# EAGLE design Bus Definition V1.1 (EAGLE 7.6.0)
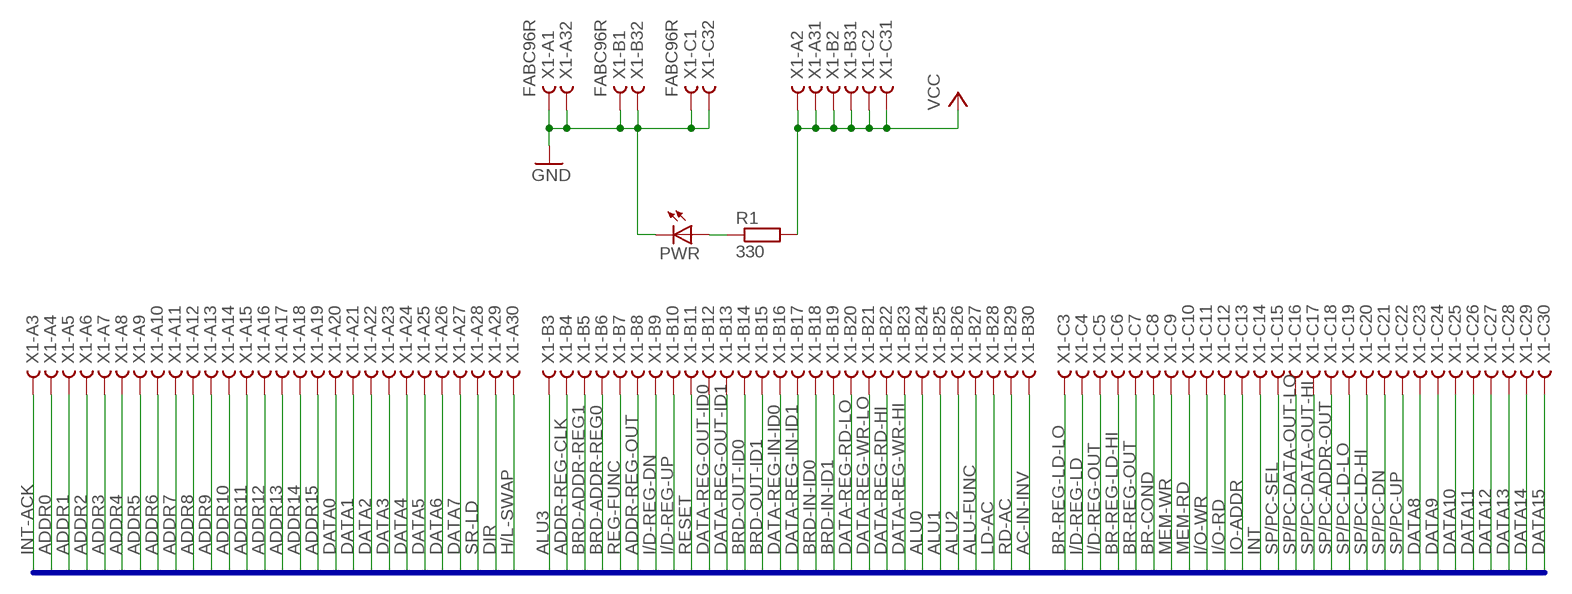
[diagram p0: schematic, sheet 1]

## Parts
PWR  LED5MM  [LED5MM]
R1  330  R0207/10  [0207/10]
X1  FABC96R  [FABC96R]

## Nets
AC-IN-INV: X1.B30
ADDR0: X1.A4
ADDR1: X1.A5
ADDR2: X1.A6
ADDR3: X1.A7
ADDR4: X1.A8
ADDR5: X1.A9
ADDR6: X1.A10
ADDR7: X1.A11
ADDR8: X1.A12
ADDR9: X1.A13
ADDR10: X1.A14
ADDR11: X1.A15
ADDR12: X1.A16
ADDR13: X1.A17
ADDR14: X1.A18
ADDR15: X1.A19
ADDR-REG-CLK: X1.B4
ADDR-REG-OUT: X1.B8
ALU0: X1.B24
ALU1: X1.B25
ALU2: X1.B26
ALU3: X1.B3
ALU-FUNC: X1.B27
BR-COND: X1.C8
BR-REG-LD-HI: X1.C6
BR-REG-LD-LO: X1.C3
BR-REG-OUT: X1.C7
BRD-ADDR-REG0: X1.B6
BRD-ADDR-REG1: X1.B5
BRD-IN-ID0: X1.B18
BRD-IN-ID1: X1.B19
BRD-OUT-ID0: X1.B14
BRD-OUT-ID1: X1.B15
DATA0: X1.A20
DATA1: X1.A21
DATA2: X1.A22
DATA3: X1.A23
DATA4: X1.A24
DATA5: X1.A25
DATA6: X1.A26
DATA7: X1.A27
DATA8: X1.C23
DATA9: X1.C24
DATA10: X1.C25
DATA11: X1.C26
DATA12: X1.C27
DATA13: X1.C28
DATA14: X1.C29
DATA15: X1.C30
DATA-REG-IN-ID0: X1.B16
DATA-REG-IN-ID1: X1.B17
DATA-REG-OUT-ID0: X1.B12
DATA-REG-OUT-ID1: X1.B13
DATA-REG-RD-HI: X1.B22
DATA-REG-RD-LO: X1.B20
DATA-REG-WR-HI: X1.B23
DATA-REG-WR-LO: X1.B21
DIR: X1.A29
GND: PWR.K(C) X1.A1 X1.A32 X1.B1 X1.B32 X1.C1 X1.C32
H/L-SWAP: X1.A30
I/D-REG-DN: X1.B9
I/D-REG-LD: X1.C4
I/D-REG-OUT: X1.C5
I/D-REG-UP: X1.B10
I/O-RD: X1.C12
I/O-WR: X1.C11
INT: X1.C14
INT-ACK: X1.A3
IO-ADDR: X1.C13
LD-AC: X1.B28
MEM-RD: X1.C10
MEM-WR: X1.C9
N$10: PWR.A R1.1
RD-AC: X1.B29
REG-FUNC: X1.B7
RESET: X1.B11
SP/PC-ADDR-OUT: X1.C18
SP/PC-DATA-OUT-HI: X1.C17
SP/PC-DATA-OUT-LO: X1.C16
SP/PC-DN: X1.C21
SP/PC-LD-HI: X1.C20
SP/PC-LD-LO: X1.C19
SP/PC-SEL: X1.C15
SP/PC-UP: X1.C22
SR-LD: X1.A28
VCC: R1.2 X1.A2 X1.A31 X1.B2 X1.B31 X1.C2 X1.C31

## Buses
ADDR[0..15],DATA[0..15],SR-LD,DIR,H/L-SWAP,ADDR-REG-CLK,BRD-ADDR-REG[0..1],REG-FUNC,ADDR-REG-OUT,I/D-REG-DN,I/D-REG-UP,RESET,DATA-REG-OUT-ID[0..1],BRD-OUT-ID[0..1],DATA-REG-IN-ID[0..1],BRD-IN-ID[0..1],DATA-REG-RD-LO,DATA-REG-WR-LO,DATA-REG-RD-HI,DATA-REG-WR-HI,ALU[0..3],ALU-FUNC,LD-AC,RD-AC,AC-IN-INV,BR-REG-LD-LO,I/D-REG-LD,I/D-REG-OUT,BR-REG-LD-HI,BR-REG-OUT,BR-COND,MEM-WR,MEM-RD,I/O-WR,I/O-RD,IO-ADDR,INT,SP/PC-SEL,SP/PC-DATA-OUT-LO,SP/PC-DATA-OUT-HI,SP/PC-ADDR-OUT,SP/PC-LD-LO,SP/PC-LD-HI,SP/PC-DN,SP/PC-UP,INT-ACK

## Library data of the parts
PWR = led:LED: LED OSRAM: - CHIPLED LG R971, LG N971, LY N971, LG Q971, LY Q971, LO R971, LY R971 LH N974, LH R974 LS Q976, LO Q976, LY Q976 LO Q996 - Hyper CHIPLED LW Q18S LB Q993, LB Q99A, LB R99A - SideLED LS A670, LO A670, LY A670, LG A670, LP A670 LB A673, LV A673, LT A673, LW A673 LH A674 LY A675 LS A676, LA A676, LO A676, LY A676, LW A676 LS A679, LY A679, LG A679 - Hyper Micro SIDELED® LS Y876, LA Y876, LO Y876, LY Y876 LT Y87S - SmartLED LW L88C, LW L88S LB L89C, LB L89S, LG L890 LS L89K, LO L89K, LY L89K LS L896, LA L896, LO L896, LY L896 - TOPLED LS T670, LO T670, LY T670, LG T670, LP T670 LSG T670, LSP T670, LSY T670, LOP T670, LYG T670 LG T671, LOG T671, LSG T671 LB T673, LV T673, LT T673, LW T673 LH T674 LS T676, LA T676, LO T676, LY T676, LB T676, LH T676, LSB T676, LW T676 LB T67C, LV T67C, LT T67C, LS T67K, LO T67K, LY T67K, LW E67C LS E67B, LA E67B, LO E67B, LY E67B, LB E67C, LV E67C, LT E67C LW T67C LS T679, LY T679, LG T679 LS T770, LO T770, LY T770, LG T770, LP T770 LB T773, LV T773, LT T773, LW T773 LH T774 LS E675, LA E675, LY E675, LS T675 LS T776, LA T776, LO T776, LY T776, LB T776 LHGB T686 LT T68C, LB T68C - Hyper Mini TOPLED® LB M676 - Mini TOPLED Santana® LG M470 LS M47K, LO M47K, LY M47K Source: http://www.osram.convergy.de LUXEON: - LUMILED® LXK2-PW12-R00, LXK2-PW12-S00, LXK2-PW14-U00, LXK2-PW14-V00 LXK2-PM12-R00, LXK2-PM12-S00, LXK2-PM14-U00 LXK2-PE12-Q00, LXK2-PE12-R00, LXK2-PE12-S00, LXK2-PE14-T00, LXK2-PE14-U00 LXK2-PB12-K00, LXK2-PB12-L00, LXK2-PB12-M00, LXK2-PB14-N00, LXK2-PB14-P00, LXK2-PB14-Q00 LXK2-PR12-L00, LXK2-PR12-M00, LXK2-PR14-Q00, LXK2-PR14-R00 LXK2-PD12-Q00, LXK2-PD12-R00, LXK2-PD12-S00 LXK2-PH12-R00, LXK2-PH12-S00 LXK2-PL12-P00, LXK2-PL12-Q00, LXK2-PL12-R00 Source: www.luxeon.com KINGBRIGHT: KA-3528ASYC Source: www.kingbright.com
R1 = eagle-ltspice:R: RESISTOR, European symbol; SPICEMODEL: NONE; SPICEPREFIX: R
X1 = con-vg:FABC96R: CONNECTOR female, 96 pins, type R, rows ABC, grid 2.54 mm

## Board
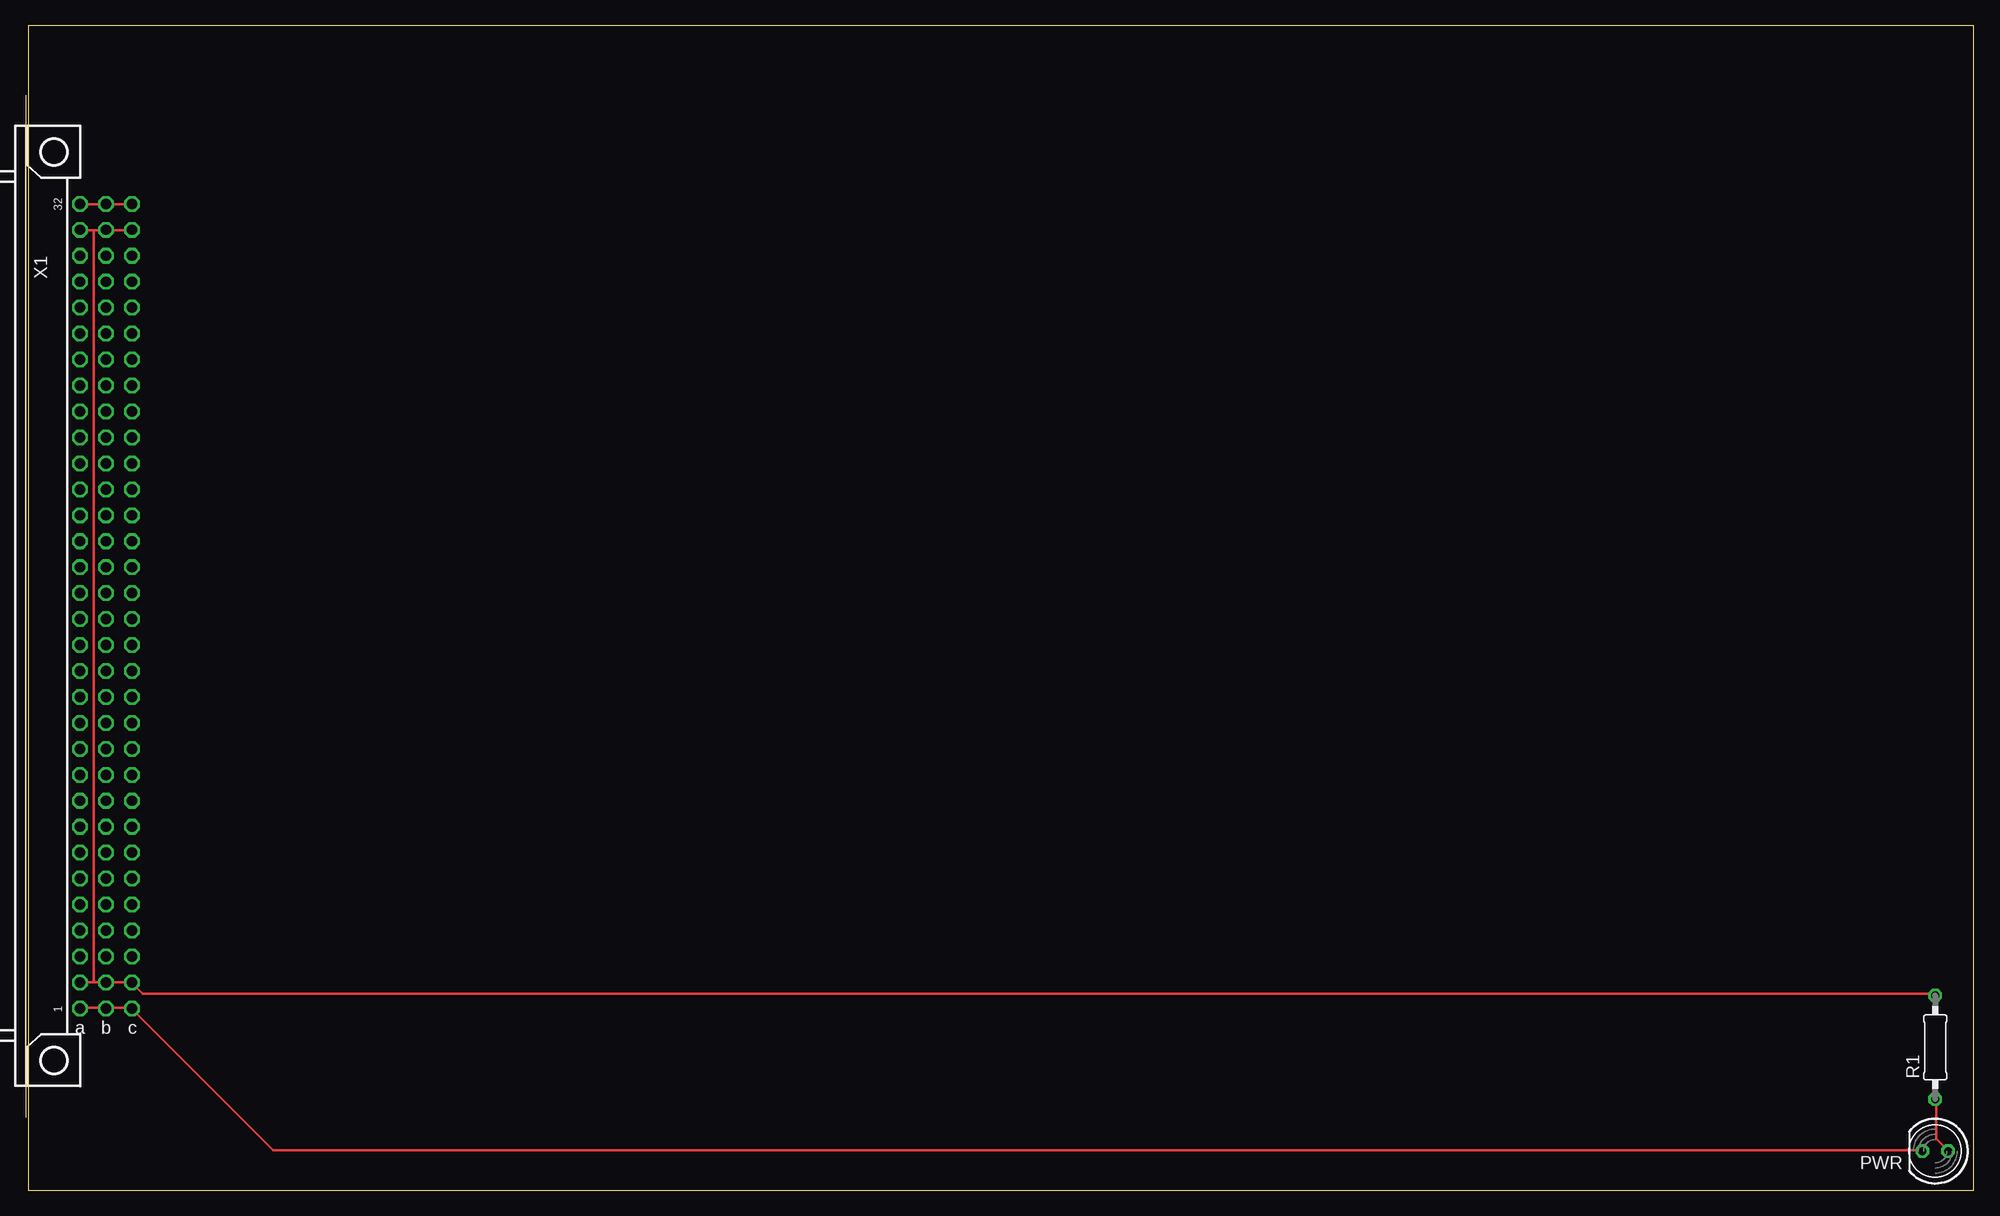
[diagram p1: board, top side]
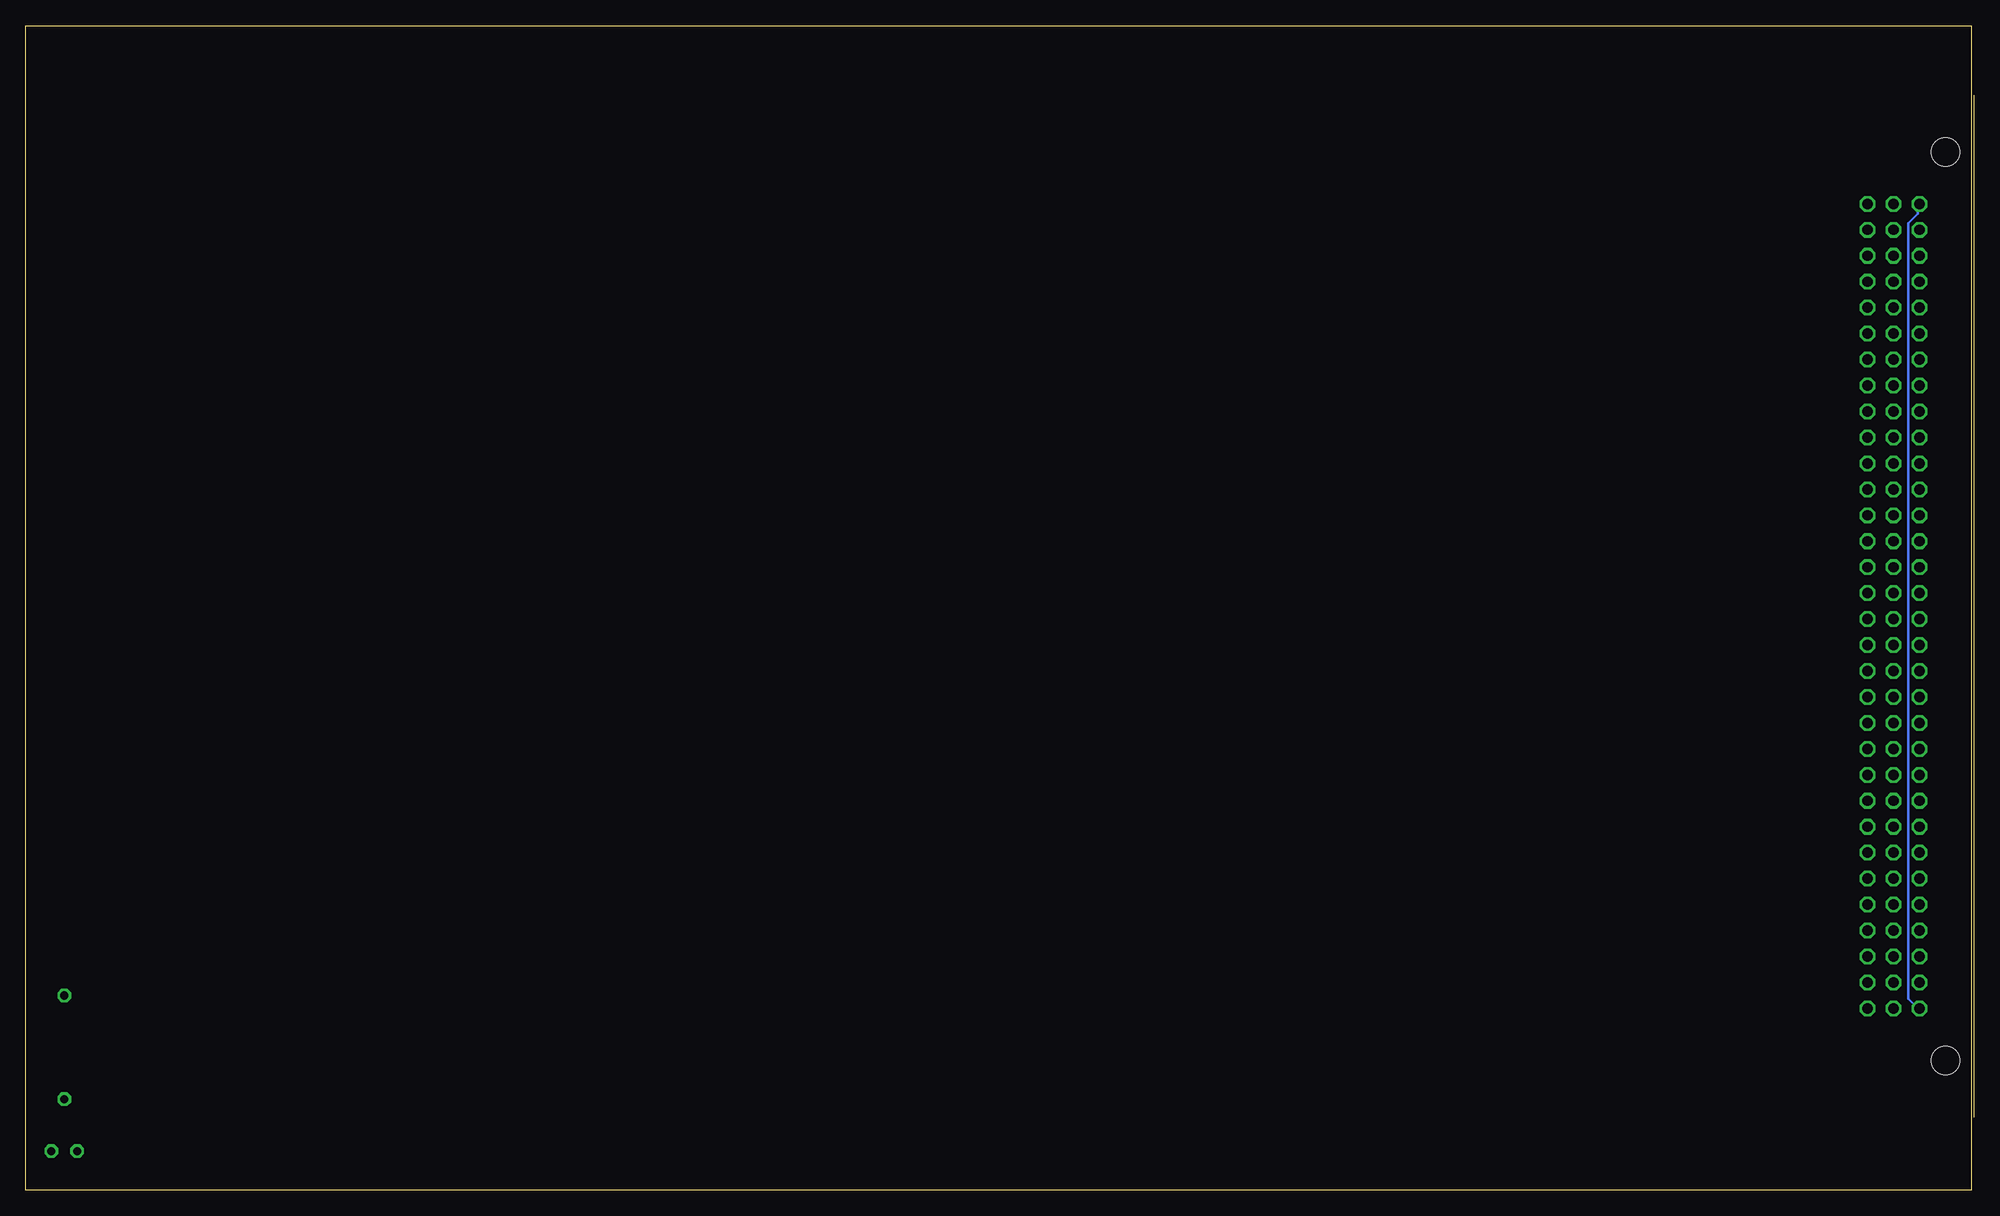
[diagram p2: board, bottom side, seen from below]

Size 190.48 x 113.97 mm. Coordinates in mm from the lower left corner, seen from the top.
Outline: 0,0 190.48,0 190.48,113.97 0,113.97 0,0
Copper layers (1*16): Top 0.035mm / dielectric 1.5mm / Bottom 0.035mm
Design rules "default": minimum track width 10mil, minimum drill 24mil, track to track 8mil, track to pad 8mil, pad to pad 8mil, via to via 8mil, smd to smd 8mil, copper to edge 40mil, drill to drill 8mil, minimum pad ring 10mil, minimum via ring 8mil, stop-mask expansion 4mil, vias tented up to drill 0mil, thermal gap 10mil

### Footprints (pad centres in the part's own frame; a part is rotated, then mirrored left to right if it is on the bottom)
LED5MM = drill 0.813 octagon: A -1.27,0; K 1.27,0
0207/10 = drill 0.813 octagon: 1 -5.08,0; 2 5.08,0
FABC96R = drill 1.016 octagon: A1 -2.54,39.37; A2 -2.54,36.83; A3 -2.54,34.29; A4 -2.54,31.75; A5 -2.54,29.21; A6 -2.54,26.67; A7 -2.54,24.13; A8 -2.54,21.59; A9 -2.54,19.05; A10 -2.54,16.51; A11 -2.54,13.97; A12 -2.54,11.43; A13 -2.54,8.89; A14 -2.54,6.35; A15 -2.54,3.81; A16 -2.54,1.27; A17 -2.54,-1.27; A18 -2.54,-3.81; A19 -2.54,-6.35; A20 -2.54,-8.89; A21 -2.54,-11.43; A22 -2.54,-13.97; A23 -2.54,-16.51; A24 -2.54,-19.05; A25 -2.54,-21.59; A26 -2.54,-24.13; A27 -2.54,-26.67; A28 -2.54,-29.21; A29 -2.54,-31.75; A30 -2.54,-34.29; A31 -2.54,-36.83; A32 -2.54,-39.37; B1 -5.08,39.37; B2 -5.08,36.83; B3 -5.08,34.29; B4 -5.08,31.75; B5 -5.08,29.21; B6 -5.08,26.67; B7 -5.08,24.13; B8 -5.08,21.59; B9 -5.08,19.05; B10 -5.08,16.51; B11 -5.08,13.97; B12 -5.08,11.43; B13 -5.08,8.89; B14 -5.08,6.35; B15 -5.08,3.81; B16 -5.08,1.27; B17 -5.08,-1.27; B18 -5.08,-3.81; B19 -5.08,-6.35; B20 -5.08,-8.89; B21 -5.08,-11.43; B22 -5.08,-13.97; B23 -5.08,-16.51; B24 -5.08,-19.05; B25 -5.08,-21.59; B26 -5.08,-24.13; B27 -5.08,-26.67; B28 -5.08,-29.21; B29 -5.08,-31.75; B30 -5.08,-34.29; B31 -5.08,-36.83; B32 -5.08,-39.37; C1 -7.62,39.37; C2 -7.62,36.83; C3 -7.62,34.29; C4 -7.62,31.75; C5 -7.62,29.21; C6 -7.62,26.67; C7 -7.62,24.13; C8 -7.62,21.59; C9 -7.62,19.05; C10 -7.62,16.51; C11 -7.62,13.97; C12 -7.62,11.43; C13 -7.62,8.89; C14 -7.62,6.35; C15 -7.62,3.81; C16 -7.62,1.27; C17 -7.62,-1.27; C18 -7.62,-3.81; C19 -7.62,-6.35; C20 -7.62,-8.89; C21 -7.62,-11.43; C22 -7.62,-13.97; C23 -7.62,-16.51; C24 -7.62,-19.05; C25 -7.62,-21.59; C26 -7.62,-24.13; C27 -7.62,-26.67; C28 -7.62,-29.21; C29 -7.62,-31.75; C30 -7.62,-34.29; C31 -7.62,-36.83; C32 -7.62,-39.37 | hole 2.794: 0,-44.456; 0,44.456

### Placement (x,y rotation side)
PWR  186.69,3.81 180 top
R1  186.69,13.97 90 top
X1  2.54,57.15 180 top

### Tracks (layer width: path | path; a pad name or v marks a point on that pad's centre or on a via)
GND
  Top 0.254: X1.A32 5.26,96.47 7.54,96.47 X1.B32 7.77,96.47 10.06,96.47 X1.C32 | X1.A1 5.26,17.83 7.54,17.83 X1.B1 7.77,17.83 10.06,17.83 X1.C1 10.29,17.6 24,3.89 185.4,3.89 PWR.K
  Bottom 0.254: X1.A32 5.26,96.47 5.26,95.56 6.17,94.64 6.17,18.75 5.26,17.83 X1.A1
N$10
  Top 0.254: R1.1 186.77,8.69 186.77,5.03 187.91,3.89 PWR.A
VCC
  Top 0.254: 6.4,93.95 7.54,93.95 X1.B31 7.77,93.95 10.06,93.95 X1.C31 | 6.4,93.95 5.26,93.95 X1.A31 | 6.4,20.34 7.54,20.34 X1.B2 7.77,20.34 10.06,20.34 X1.C2 10.29,20.12 11.2,19.2 186.54,19.2 R1.2 | 6.4,20.34 5.26,20.34 X1.A2 | 6.4,20.34 6.4,93.95

### Text on the board
tCream: YACC1 BOARD NAME VX.Y | onepagecomputer.com